# Altium schematic sheet OZ440-SE100-CAR003_sheet3.SchDoc
size A3
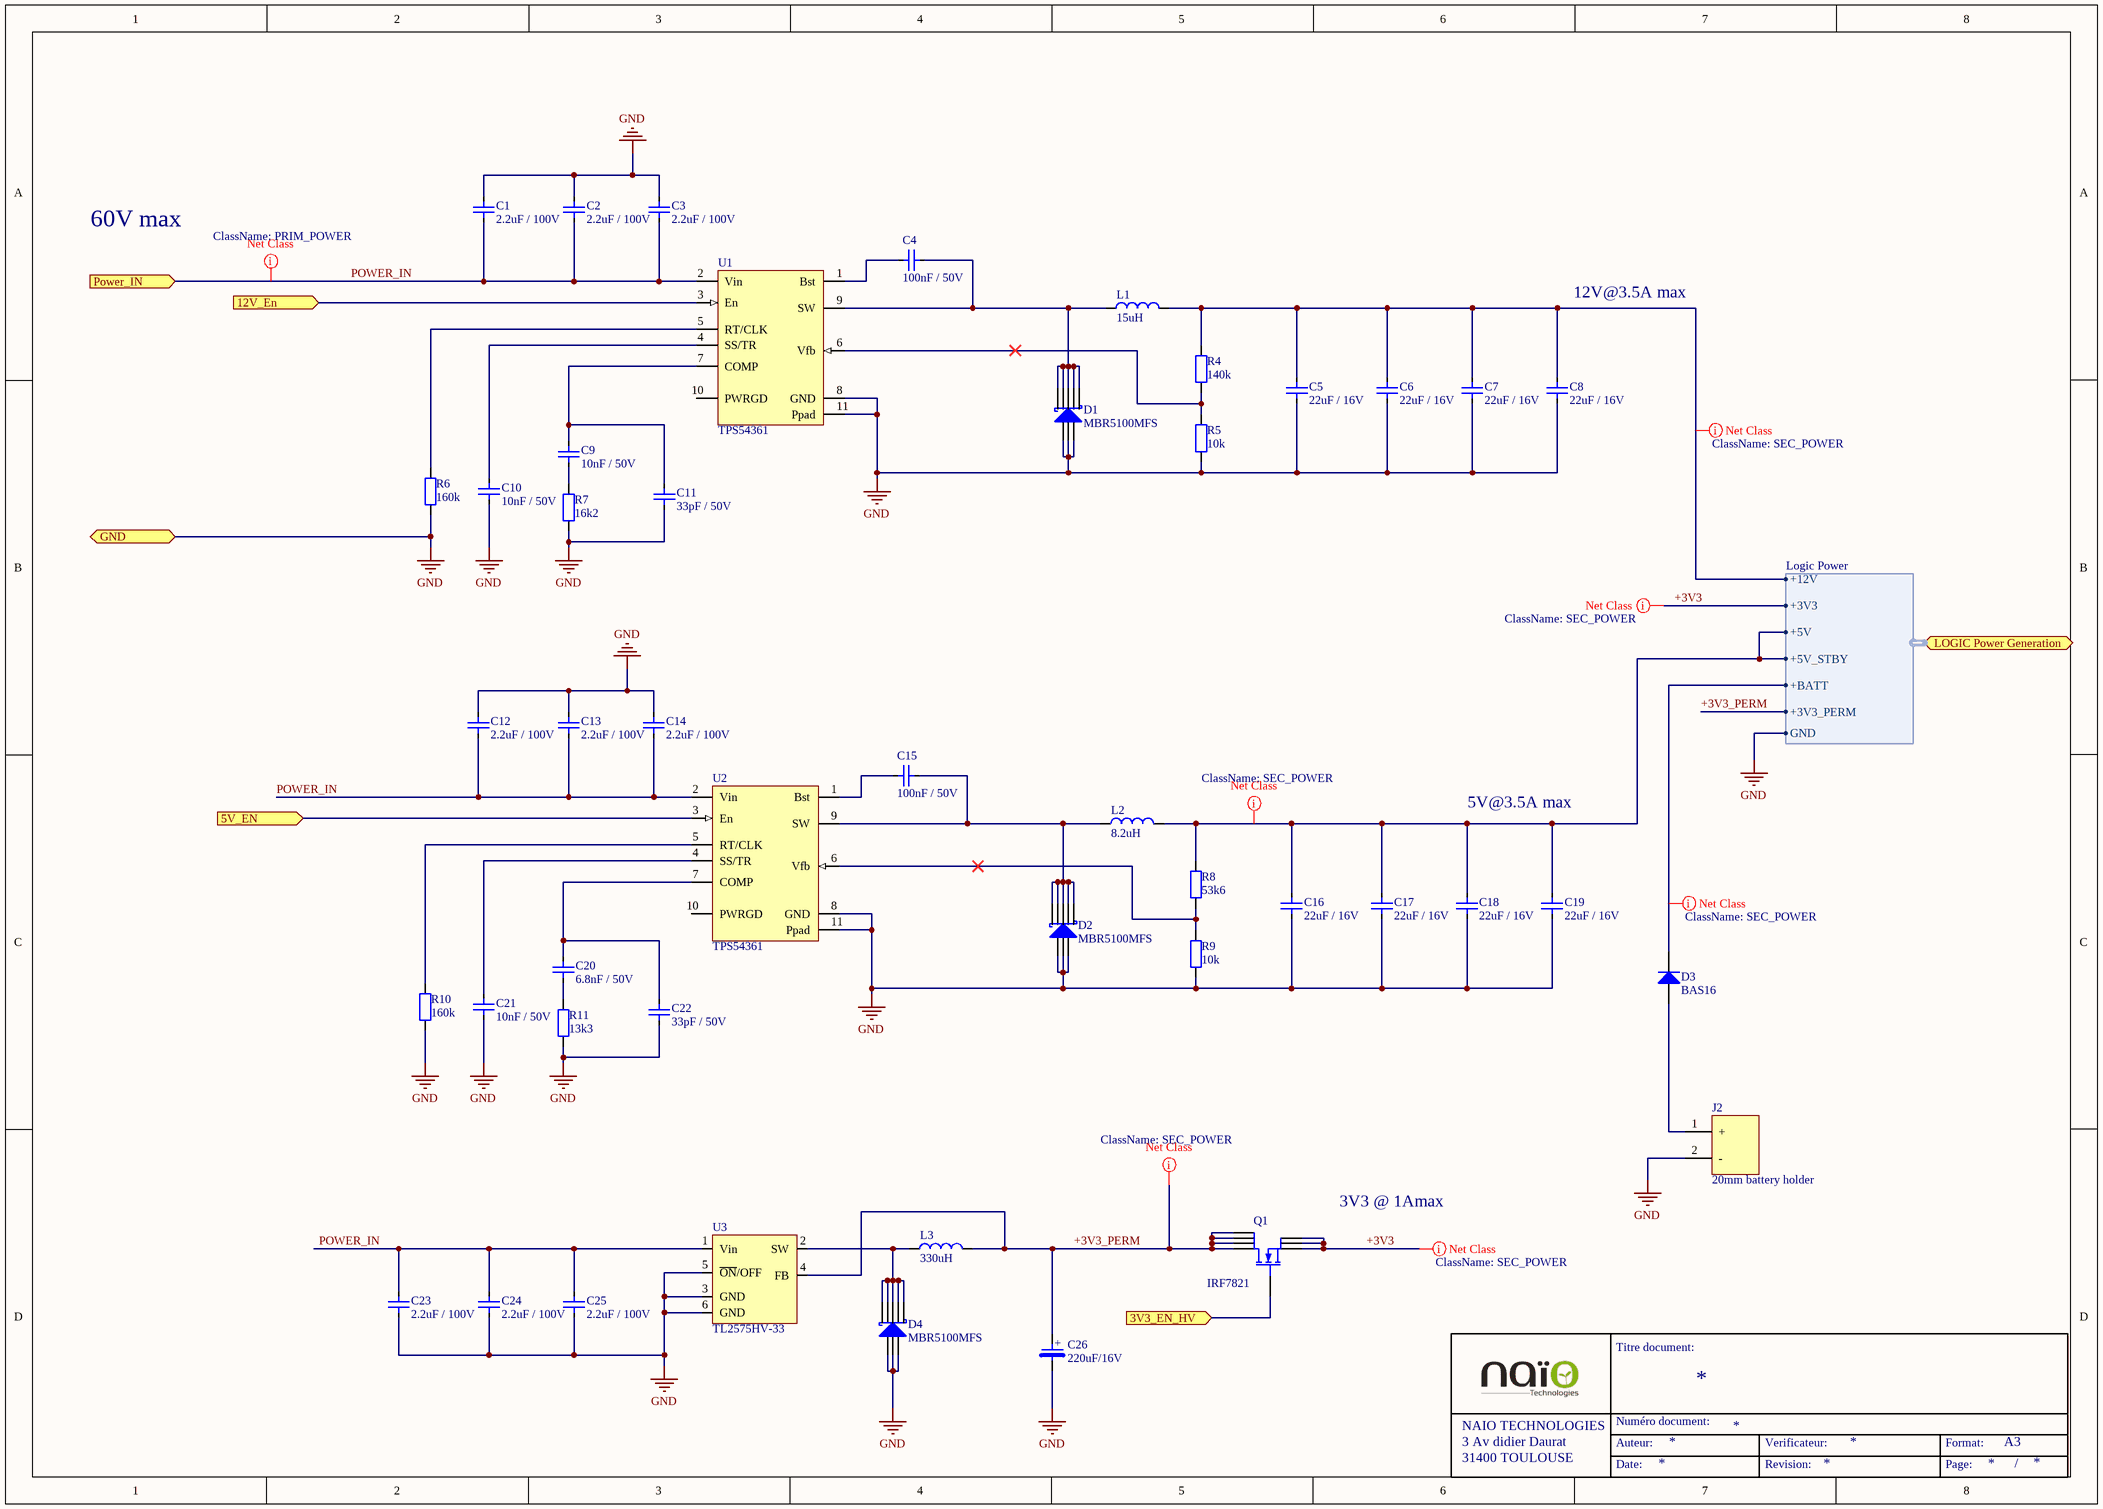
[diagram p0: OZ440-SE100-CAR003_sheet3.SchDoc]

## Parts
C1  Displayed reference: 2.2uF / 100V  [C1206-STD]  (hidden comment: CAP-SMD)
C2  Displayed reference: 2.2uF / 100V  [C1206-STD]  (hidden comment: CAP-SMD)
C3  Displayed reference: 2.2uF / 100V  [C1206-STD]  (hidden comment: CAP-SMD)
C4  Displayed reference: 100nF / 50V  [C0805-STD]  (hidden comment: CAP-SMD)
C5  Displayed reference: 22uF / 16V  [C1210-STD]  (hidden comment: CAP-SMD)
C6  Displayed reference: 22uF / 16V  [C1210-STD]  (hidden comment: CAP-SMD)
C7  Displayed reference: 22uF / 16V  [C1210-STD]  (hidden comment: CAP-SMD)
C8  Displayed reference: 22uF / 16V  [C1210-STD]  (hidden comment: CAP-SMD)
C9  Displayed reference: 10nF / 50V  [C0805-STD]  (hidden comment: CAP-SMD)
C10  Displayed reference: 10nF / 50V  [C0805-STD]  (hidden comment: CAP-SMD)
C11  Displayed reference: 33pF / 50V  [C0805-STD]  (hidden comment: CAP-SMD)
C12  Displayed reference: 2.2uF / 100V  [C1206-STD]  (hidden comment: CAP-SMD)
C13  Displayed reference: 2.2uF / 100V  [C1206-STD]  (hidden comment: CAP-SMD)
C14  Displayed reference: 2.2uF / 100V  [C1206-STD]  (hidden comment: CAP-SMD)
C15  Displayed reference: 100nF / 50V  [C0805-STD]  (hidden comment: CAP-SMD)
C16  Displayed reference: 22uF / 16V  [C1210-STD]  (hidden comment: CAP-SMD)
C17  Displayed reference: 22uF / 16V  [C1210-STD]  (hidden comment: CAP-SMD)
C18  Displayed reference: 22uF / 16V  [C1210-STD]  (hidden comment: CAP-SMD)
C19  Displayed reference: 22uF / 16V  [C1210-STD]  (hidden comment: CAP-SMD)
C20  Displayed reference: 6.8nF / 50V  [C0805-STD]  (hidden comment: CAP-SMD)
C21  Displayed reference: 10nF / 50V  [C0805-STD]  (hidden comment: CAP-SMD)
C22  Displayed reference: 33pF / 50V  [C0805-STD]  (hidden comment: CAP-SMD)
C23  Displayed reference: 2.2uF / 100V  [C1206-STD]  (hidden comment: CAP-SMD)
C24  Displayed reference: 2.2uF / 100V  [C1206-STD]  (hidden comment: CAP-SMD)
C25  Displayed reference: 2.2uF / 100V  [C1206-STD]  (hidden comment: CAP-SMD)
C26  Displayed reference: 220uF/16V  [CAP-ELECTRO-SMD]  (hidden comment: CAP-POL-SMD)
D1  Displayed reference: MBR5100MFS  [SO8-SPE-MBR5100MFS]  (hidden comment: MBR5100MFS-SO8)
D2  Displayed reference: MBR5100MFS  [SO8-SPE-MBR5100MFS]  (hidden comment: MBR5100MFS-SO8)
D3  Displayed reference: BAS16  [SOT23-STD]  (hidden comment: BAS16-SOT23)
D4  Displayed reference: MBR5100MFS  [SO8-SPE-MBR5100MFS]  (hidden comment: MBR5100MFS-SO8)
J2  Displayed reference: 20mm battery holder  [CONN-SPE-Keyst_1081]  (hidden comment: CONN-STD-2P_BATTERY)
L1  Displayed reference: 15uH  [L-SPE-XAL60xx]  (hidden comment: IND-SMD)
L2  Displayed reference: 8.2uH  [L-SPE-XAL60xx]  (hidden comment: IND-SMD)
L3  Displayed reference: 330uH  [L-SPE-MSS1260]  (hidden comment: IND-SMD)
Q1  Displayed reference: IRF7821  [SO8-SPE-IRF7832]  (hidden comment: IRF7832-SO8)
R4  Displayed reference: 140k  [R0805-STD]  (hidden comment: RES-SMD)
R5  Displayed reference: 10k  [R0805-STD]  (hidden comment: RES-SMD)
R6  Displayed reference: 160k  [R0805-STD]  (hidden comment: RES-SMD)
R7  Displayed reference: 16k2  [R0805-STD]  (hidden comment: RES-SMD)
R8  Displayed reference: 53k6  [R0805-STD]  (hidden comment: RES-SMD)
R9  Displayed reference: 10k  [R0805-STD]  (hidden comment: RES-SMD)
R10  Displayed reference: 160k  [R0805-STD]  (hidden comment: RES-SMD)
R11  Displayed reference: 13k3  [R0805-STD]  (hidden comment: RES-SMD)
U1  Displayed reference: TPS54361  [SON10-SPE-TPS54361]  (hidden comment: TPS54361-SON10)
U2  Displayed reference: TPS54361  [SON10-SPE-TPS54361]  (hidden comment: TPS54361-SON10)
U3  Displayed reference: TL2575HV-33  [TO263-5-SPE-TL2575HV]  (hidden comment: TL2575HV-xx-TO263)

## Ports
3V3_EN_HV (in), 5V_EN (in), 12V_En (in), GND, LOGIC Power Generation (harness Logic Power), Power_IN (in)

## Harnesses
Logic Power: +12V, +3V3, +5V, +5V_STBY, +BATT, GND, +3V3_PERM

## Nets
GND: C1.2 C2.2 C3.2 C5.1 C6.1 C7.1 C8.1 C10.1 C11.1 C12.2 C13.2 C14.2 C16.1 C17.1 C18.1 C19.1 C21.1 C22.1 C23.1 C24.1 C25.1 C26.2 D1.1(A) D1.2(A) D1.3(A) D2.1(A) D2.2(A) D2.3(A) D4.1(A) D4.2(A) D4.3(A) J2.2(-) R5.1 R6.2 R7.1 R9.1 R10.2 R11.1 U1.8(GND) U1.11(Ppad) U2.8(GND) U2.11(Ppad) U3.3(GND) U3.5(~{ON}/OFF) U3.6(GND) ; port GND, port LOGIC Power Generation.GND
3V3_EN_HV: Q1.4(G) ; port 3V3_EN_HV
5V_EN: U2.3(En) ; port 5V_EN
12V_En: U1.3(En) ; port 12V_En
+3V3: Q1.1(S) Q1.2(S) Q1.3(S) ; port LOGIC Power Generation.+3V3
+3V3_PERM: C26.1 L3.2 Q1.5(D) Q1.6(D) Q1.7(D) Q1.8(D) U3.4(FB) ; port LOGIC Power Generation.+3V3_PERM
POWER_IN: C1.1 C2.1 C3.1 C12.1 C13.1 C14.1 C23.2 C24.2 C25.2 U1.2(Vin) U2.2(Vin) U3.1(Vin) ; port Power_IN
NetC4_1: C4.1 U1.1(Bst)
NetC4_2: C4.2 D1.5(K) D1.6(K) D1.7(K) D1.8(K) L1.1 U1.9(SW)
NetC5_2: C5.2 C6.2 C7.2 C8.2 L1.2 R4.2 ; port LOGIC Power Generation.+12V
NetC9_1: C9.1 R7.2
NetC9_2: C9.2 C11.2 U1.7(COMP)
NetC10_2: C10.2 U1.4(SS/TR)
NetC15_1: C15.1 U2.1(Bst)
NetC15_2: C15.2 D2.5(K) D2.6(K) D2.7(K) D2.8(K) L2.1 U2.9(SW)
NetC16_2: C16.2 C17.2 C18.2 C19.2 L2.2 R8.2 ; port LOGIC Power Generation.+5V, port LOGIC Power Generation.+5V_STBY
NetC20_1: C20.1 R11.2
NetC20_2: C20.2 C22.2 U2.7(COMP)
NetC21_2: C21.2 U2.4(SS/TR)
NetD3_1: D3.1(A) J2.1(+)
NetD3_3: D3.3(K) ; port LOGIC Power Generation.+BATT
NetD4_5: D4.5(K) D4.6(K) D4.7(K) D4.8(K) L3.1 U3.2(SW)
NetR4_1: R4.1 R5.2 U1.6(Vfb)
NetR6_1: R6.1 U1.5(RT/CLK)
NetR8_1: R8.1 R9.2 U2.6(Vfb)
NetR10_1: R10.1 U2.5(RT/CLK)

Not connected (* = marked no-connect by the designer): U1 10(PWRGD); U2 10(PWRGD)

## Layout directives
net class PRIM_POWER: POWER_IN
net class SEC_POWER: +3V3, +3V3_PERM, NetC5_2, NetC16_2, NetD3_3

## Notes on the sheet
- 60V max
- 12V@3.5A max
- 5V@3.5A max
- 3V3 @ 1Amax
- Titre document:
- NAIO TECHNOLOGIES
- 3 Av didier Daurat
- 31400 TOULOUSE
- Auteur:
- Numéro document:
- Verificateur:
- Format:
- A3
- Date:
- Revision:
- Page:
- /
- (in symbol B41142A4227M) +

## Library data of the parts
C1-C3 C12-C14 C23-C25 = C3216X7S2A225Kxxx: 1206 2.2uF / 100V X7S ceramic capacitor; Manufacturer: TDK; Max Voltage: 100; Tolerance: +/- 10%; Validated: N; Reference: C3216X7S2A225Kxxx; Value: 2.2uF; Material: X7S; Footprint description: standard Capacitor 1206; Pin Count: 2; helpURL: http://www.mouser.com/ds/2/400/C3216X7S2A225K160AB-265429.pdf; Supplier 1: Mouser; Supplier Part Number 1: 810-C3216X7S2A225K; Supplier 2: Farnell; Supplier Part Number 2: 2112717
C4 C15 = VJ0805Y104KXAxx: 0805 100nF / 50V  X7R ceramic capacitor; Manufacturer: vishay; Max Voltage: 50; Tolerance: +/- 10%; Validated: N; Reference: VJ0805Y104KXAxx; Value: 100nF; Material: X7R; Footprint description: standard Capacitor 0805; Pin Count: 2; helpURL: http://www.vishay.com/docs/45200/highrels.pdf; Supplier 1: Farnell; Supplier Part Number 1: 1612208; Supplier 2: Digi-Key; Supplier Part Number 2: 720-1266-6-ND
C5-C8 C16-C19 = 1210YC226KAT2A: 1210 22uF / 16V X7R ceramic capacitor; Manufacturer: AVX; Value: 100uF; Max Voltage: 16; Tolerance: +/- 10%; Validated: N; Reference: 1210YC226KAT2A; Material: X7R; Footprint description: standard Capacitor 1210; Pin Count: 2; helpURL: http://www.farnell.com/datasheets/84526.pdf; Supplier 1: Farnell; Supplier Part Number 1: 1657948; Supplier 2: Digi-Key; Supplier Part Number 2: 478-5729-1-ND
C9 C10 C21 = VJ0805Y103KXAxx: 0805 10nF / 50V X7R ceramic capacitor; Manufacturer: vishay; Max Voltage: 50; Tolerance: +/- 10%; Validated: N; Reference: VJ0805Y103KXAxx; Value: 10nF; Material: X7R; Footprint description: standard Capacitor 0805; Pin Count: 2; helpURL: http://www.vishay.com/docs/45200/highrels.pdf; Supplier 1: Farnell; Supplier Part Number 1: 1650952; Supplier 2: Digi-Key; Supplier Part Number 2: BC1293CT-ND
C11 C22 = C0805C330J5GACxx: 0805 33pF / 50V COG ceramic capacitor; Manufacturer: Kemet; Max Voltage: 50; Tolerance: +/- 10%; Validated: False; Reference: C0805C330J5GACxx; Value: 33pF; Material: COG; Footprint description: standard Capacitor 0805; Pin Count: 2; helpURL: http://www.farnell.com/datasheets/40863.pdf; Supplier 1: Mouser; Supplier Part Number 1: 80-C0805C330J5GACTM; Supplier 2: Farnell; Supplier Part Number 2: 1414685
C20 = C0805C682J5GACxx: 0805 6.8nF / 50V COG ceramic capacitor; Manufacturer: Kemet; Max Voltage: 50; Tolerance: +/- 5%; Validated: N; Reference: C0805C682J5GACxx; Value: 6.8nF; Material: COG; Footprint description: standard Capacitor 0805; Pin Count: 2; helpURL: http://www.farnell.com/datasheets/40863.pdf; Supplier 1: Mouser; Supplier Part Number 1: 80-C0805C682J5G; Supplier 2: Farnell; Supplier Part Number 2: 1535571
C26 = B41142A4227M: 220uF/16V Aluminium capacitor SMD; Manufacturer: Epcos; Value: 220uF; Max Voltage: 16V; Reference: B41142A4227M; Material: Aluminium; Footprint description: 6.3mm x 7.7mm; Pin Count: 2; helpURL: www.epcos.com/inf/20/30/db/alu_x/B41142.pdf; Supplier 1: Farnell; Supplier Part Number 1: 1735331; Supplier 2: Mouser; Supplier Part Number 2: 871-B41142A4227M
D1 D2 D4 = MBR5100MFS: Power shottky Diode; Manufacturer: ON semi; Max Voltage: 100; Max Current: 5A; Validated: False; Reference: MBR5100MFS; component type: Schottky diode; Footprint description: SO8 Flat lead; Pin Count: 10; Rev: D; helpURL: http://www.onsemi.com/pub_link/Collateral/MBR5100MFS-D.PDF; Supplier 1: Mouser; Supplier Part Number 1: 863-MBR5100MFST1G; Supplier 2: Digi-Key; Supplier Part Number 2: MBR5100MFST3G-ND
D3 = BAS16: 100V / 120mA signal  diode; Manufacturer: NXP; Max Voltage: 100; Max Current: 0.2A; Validated: False; Reference: BAS16; component type: DIODE; Footprint description: Sot23 SMD package; Pin Count: 3; Rev: 2010; helpURL: http://www.nxp.com/documents/data_sheet/BAS16_SER.pdf; Supplier 1: Farnell; Supplier Part Number 1: 1081180; Supplier 2: Digi-Key; Supplier Part Number 2: 568-1596-1-ND
J2 = 1081: 20mm battery Holder, SMT; Manufacturer: Keystone; Reference: 1081; Validated: False; Material: HT nylon; Footprint description: 20mm SMT battery holder; Pin Count: 2; Rev: A; helpURL: http://www.keyelco.com/product.cfm/Surface-Mount/1081/p/404/id/406/c_id/992/product_id/731; Supplier 1: Farnell; Supplier Part Number 1: 1888399; Supplier 2: Mouser; Supplier Part Number 2: 534-1081
L1 = XAL6060-153ME: 15uH SMD inductor; Manufacturer: COILCRAFT; Max Current: 6A; Frequency band: 11Mhz; Validated: False; Reference: XAL6060-153ME; Value: 15uH; Footprint description: SMD 2 pin; Pin Count: 2; Rev: 11/20/12; helpURL: http://www.coilcraft.com/pdfs/xal60xx.pdf; Supplier 1: Mouser; Supplier Part Number 1: 994-XAL6060-153MEB; Supplier 2: Farnell; Supplier Part Number 2: 2289092
L2 = XAL6060-822ME: 8.2uH SMD inductor; Manufacturer: COILCRAFT; Max Current: 8A; Frequency band: 16Mhz; Validated: False; Reference: XAL6060-822ME; Value: 8.2uH; Footprint description: SMD 2 pin; Pin Count: 2; Rev: 11/20/12; helpURL: http://www.coilcraft.com/pdfs/xal60xx.pdf; Supplier 1: Mouser; Supplier Part Number 1: 994-XAL6060-822MEB; Supplier 2: Farnell; Supplier Part Number 2: 2289089
L3 = MSS1260-334KL: 330uH SMD inductor; Manufacturer: COILCRAFT; Max Current: 1.16A; Frequency band: 4Mhz; Validated: False; Reference: MSS1260-334KL; Value: 330uH; Footprint description: SMD 2 pin; Pin Count: 2; Rev: 10/31/11; helpURL: http://www.coilcraft.com/pdfs/mss1260.pdf; Supplier 1: Mouser; Supplier Part Number 1: 994-MSS1260-334KLB; Supplier 2: Farnell; Supplier Part Number 2: 2288413RL
Q1 = IRF7821PBF: 11A N channel MOSFET in SO08 package; Manufacturer: IRF; Max Voltage: 30V; Rated Power: 2.5W; Validated: False; Reference: IRF7821PBF; component type: NMOS; Max Current: 11A; Footprint description: SO08; Pin Count: 8; Rev: 30/06/05; helpURL: http://www.irf.com/product-info/datasheets/data/irf7821.pdf; Supplier 1: Farnell; Supplier Part Number 1: 1013495; Supplier 2: Digi-Key; Supplier Part Number 2: IRF7821PBFCT-ND
R4 = CRCW0805140KFKxx: 140k Ohm 0805 SMD resistor; Manufacturer: Vishay; Value: 140 000; Tolerance: 1%; Rated Power: 0.125W; Validated: False; Reference: CRCW0805140KFKxx; Footprint description: standard 0805 SMD; Pin Count: 2; helpURL: http://www.vishay.com/docs/20035/dcrcwe3.pdf; Supplier 1: Mouser; Supplier Part Number 1: 71-CRCW0805-140K-E3; Supplier 2: Farnell; Supplier Part Number 2: 1260846
R5 R9 = CRCW080510K0FKxx: 10k Ohm 0805 SMD resistor; Manufacturer: Vishay; Value: 10 000; Tolerance: 1 %; Rated Power: 0,125 W; Validated: No; Reference: CRCW080510K0FKxx; Footprint description: standard 0805 SMD; Pin Count: 2; helpURL: http://www.vishay.com/docs/20035/dcrcwe3.pdf; Supplier 1: Farnell; Supplier Part Number 1: 1469856; Supplier 2: Mouser; Supplier Part Number 2: 71-CRCW0805-10K-E3
R6 R10 = CRCW0805160KFKxx: 160k Ohm 0805 SMD resistor; Manufacturer: Vishay; Value: 160 000; Tolerance: 1%; Rated Power: 0.125W; Validated: False; Reference: CRCW0805160KFKxx; Footprint description: standard 0805 SMD; Pin Count: 2; helpURL: http://www.vishay.com/docs/20035/dcrcwe3.pdf; Supplier 1: Farnell; Supplier Part Number 1: 1246882; Supplier 2: Mouser; Supplier Part Number 2: 71-CRCW0805160KFKEA
R7 = CRCW080516K2FKxx: 16k2 Ohm 0805 SMD resistor; Manufacturer: Vishay; Value: 16200; Tolerance: 1%; Rated Power: 0.125W; Validated: No; Reference: CRCW080516K2FKxx; Footprint description: standard 0805 SMD; Pin Count: 2; helpURL: http://www.vishay.com/docs/20035/dcrcwe3.pdf; Supplier 1: Mouser; Supplier Part Number 1: 71-CRCW0805-16.2K-E3; Supplier 2: Farnell; Supplier Part Number 2: 1469878
R8 = CRCW080553K6FKxx: 53k6 Ohm 0805 SMD resistor; Manufacturer: Vishay; Value: 53600; Tolerance: 1%; Rated Power: 0.125W; Validated: No; Reference: CRCW080553K6FKxx; Footprint description: standard 0805 SMD; Pin Count: 2; helpURL: http://www.vishay.com/docs/20035/dcrcwe3.pdf; Supplier 1: Mouser; Supplier Part Number 1: 71-CRCW080553K6FKEA; Supplier 2: Farnell; Supplier Part Number 2: 1185098
R11 = CRCW080513K3FKxx: 13k3 Ohm 0805 SMD resistor; Manufacturer: Vishay; Value: 13 300; Tolerance: 1%; Rated Power: 0.125W; Validated: No; Reference: CRCW080513K3FKxx; Footprint description: standard 0805 SMD; Pin Count: 2; helpURL: http://www.vishay.com/docs/20035/dcrcwe3.pdf; Supplier 1: Mouser; Supplier Part Number 1: 71-CRCW0805-13.3K-E3; Supplier 2: Farnell; Supplier Part Number 2: 1260840
U1 U2 = TPS54361DPRx: 4.5-V to 60-V Input, 3.5-A, Step Down DC-DC Converter; Manufacturer: TI; Max Voltage: 60V; Max Current: 3.5A; Validated: False; Reference: TPS54361DPRx; Footprint description: SON10 SMD package; Pin Count: 10; Rev: 12/2013; helpURL: http://www.ti.com/lit/ds/symlink/tps54361.pdf; Supplier 1: Farnell; Supplier Part Number 1: 2392482; Supplier 2: Digi-Key; Supplier Part Number 2: 296-37248-6-ND
U3 = TL2575HV-33-Q1: 1-A SIMPLE STEP-DOWN VOLTAGE REGULATOR; Manufacturer: TI; Max Voltage: 60; Max Current: 1; Validated: False; Reference: TL2575HV-33-Q1; Footprint description: D2PAK 5 pin; Pin Count: 6; Rev: 09/10; helpURL: http://www.ti.com/lit/ds/symlink/tl2575hv-05-q1.pdf; Supplier 1: Mouser; Supplier Part Number 1: 595-L2575HV33QKTTRQ1; Supplier 2: Digi-Key; Supplier Part Number 2: 296-36739-1-ND